# EAGLE design 154N_NAU7802 (EAGLE 9.6.2)
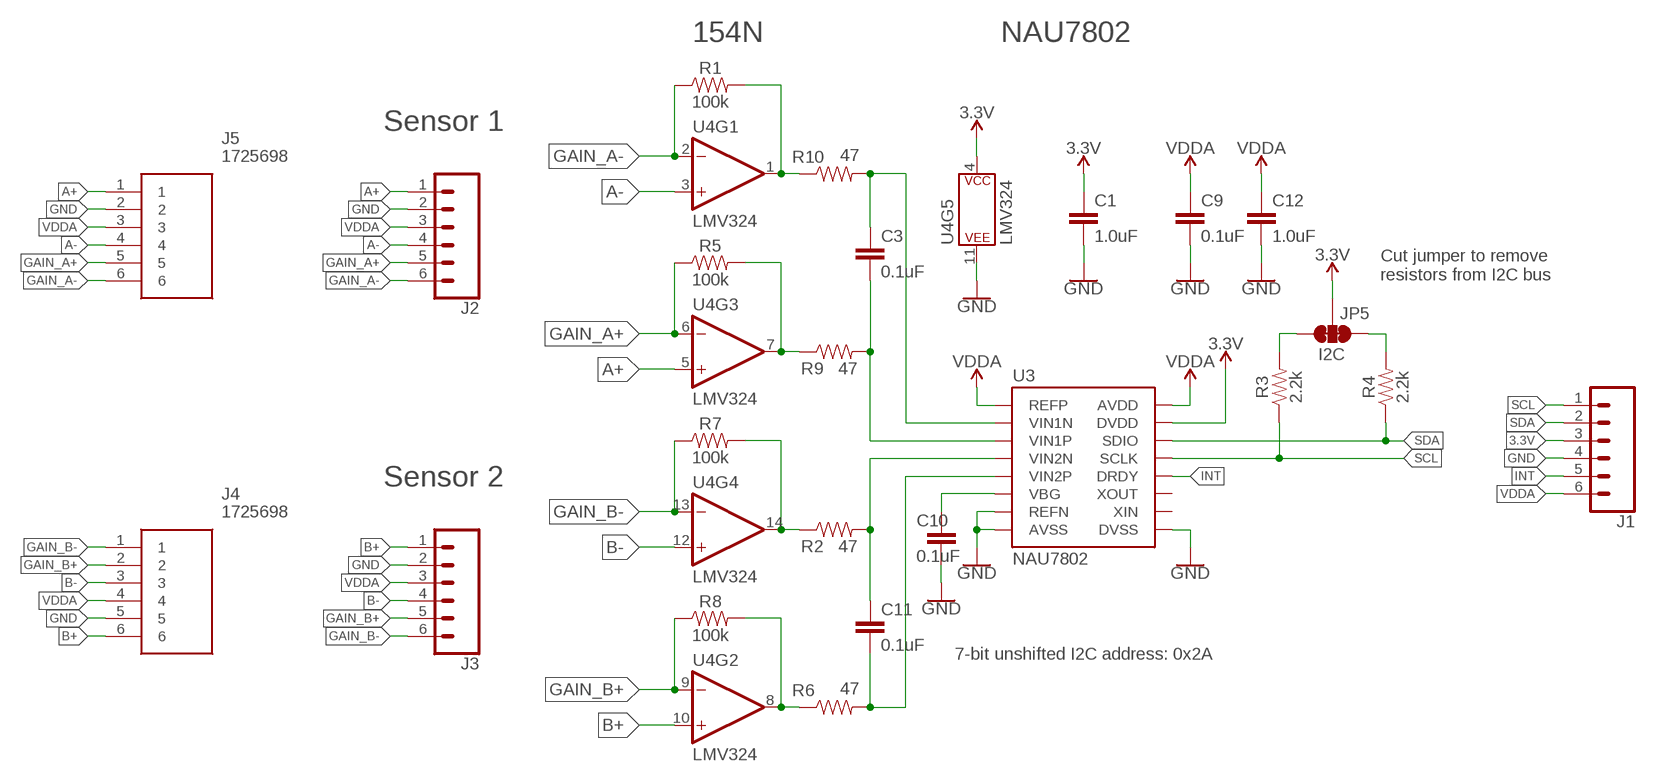
[diagram p0: schematic, sheet 1]

## Parts
C1  1.0uF  1.0UF-0603-16V-10%  [0603]
C3  0.1uF  0.1UF-0603-25V-(+80/-20%)  [0603]
C9  0.1uF  0.1UF-0603-25V-(+80/-20%)  [0603]
C10  0.1uF  0.1UF-0603-25V-(+80/-20%)  [0603]
C11  0.1uF  0.1UF-0603-25V-(+80/-20%)  [0603]
C12  1.0uF  1.0UF-0603-16V-10%  [0603]
J1  CONN_06SILK_FEMALE_PTH  [1X06]
J2  CONN_06SILK_FEMALE_PTH  [1X06]
J3  CONN_06SILK_FEMALE_PTH  [1X06]
J4  1725698  [SHDR6W90P0X254_1X6_1570X620X85]
J5  1725698  [SHDR6W90P0X254_1X6_1570X620X85]
JP5  I2C  JUMPER-SMT_3_2-NC_TRACE_SILK  [SMT-JUMPER_3_2-NC_TRACE_SILK]
R1  100k  100KOHM-0603-1/10W-1%  [0603]
R2  47  47OHM-0603-1/10W-1%  [0603]
R3  2.2k  2.2KOHM-0603-1/10W-1%  [0603]
R4  2.2k  2.2KOHM-0603-1/10W-1%  [0603]
R5  100k  100KOHM-0603-1/10W-1%  [0603]
R6  47  47OHM-0603-1/10W-1%  [0603]
R7  100k  100KOHM-0603-1/10W-1%  [0603]
R8  100k  100KOHM-0603-1/10W-1%  [0603]
R9  47  47OHM-0603-1/10W-1%  [0603]
R10  47  47OHM-0603-1/10W-1%  [0603]
U3  NAU7802  SPARKFUN-IC-CONVERSION_NAU7802SOIC  [SPARKFUN-IC-CONVERSION_SO16]
U4  LMV324  SPARKFUN-IC-AMPLIFIERS_LMV324  [SPARKFUN-IC-AMPLIFIERS_SO14]

## Nets
3.3V [3.3V]: C1.1 J1.3 JP5.2 U3.15(DVDD) U4.4(P$V+)
A+: J2.1 J5.1 U4.5(+IN)
A-: J2.4 J5.4 U4.3(+IN)
B+: J3.1 J4.6 U4.10(+IN)
B-: J3.4 J4.3 U4.12(+IN)
GAIN_A+: J2.5 J5.5 R5.1 U4.6(-IN)
GAIN_A-: J2.6 J5.6 R1.1 U4.2(-IN)
GAIN_B+: J3.5 J4.2 R8.1 U4.9(-IN)
GAIN_B-: J3.6 J4.1 R7.1 U4.13(-IN)
GND: C1.2 C9.2 C10.2 C12.2 J1.4 J2.2 J3.2 J4.5 J5.2 U3.7(REFN) U3.8(AVSS) U3.9(DVSS) U4.11(P$V-)
INT: J1.5 U3.12(DRDY)
N$1: R6.1 R8.2 U4.8(OUT)
N$3: JP5.1 R4.2
N$4: JP5.3 R3.2
N$6: R2.1 R7.2 U4.14(OUT)
N$9: R1.2 R10.1 U4.1(OUT)
N$10: R5.2 R9.1 U4.7(OUT)
N$11: C10.1 U3.6(VBG)
N$12: C3.2 R9.2 U3.3(VIN1P)
N$13: C3.1 R10.2 U3.2(VIN1N)
N$14: C11.2 R6.2 U3.5(VIN2P)
N$15: C11.1 R2.2 U3.4(VIN2N)
SCL: J1.1 R3.1 U3.13(SCLK)
SDA: J1.2 R4.1 U3.14(SDIO)
VDDA: C9.1 C12.1 J1.6 J2.3 J3.3 J4.4 J5.3 U3.1(REFP) U3.16(AVDD)
Unconnected: U3.10(XIN) U3.11(XOUT)

## Notes on the sheet
- 154N | NAU7802
- Sensor 1
- Cut jumper to remove
  resistors from I2C bus
- Sensor 2
- 7-bit unshifted I2C address: 0x2A

## Library data of the parts
C1 C12 = SparkFun-Capacitors:1.0UF: 1µF ceramic capacitors A capacitor is a passive two-terminal electrical component used to store electrical energy temporarily in an electric field.; PROD_ID: CAP-00868
C3 C9-C11 = SparkFun-Capacitors:0.1UF: 0.1µF ceramic capacitors A capacitor is a passive two-terminal electrical component used to store electrical energy temporarily in an electric field.; PROD_ID: CAP-00810
J1-J3 = SparkFun-Connectors:CONN_06: Multi connection point. Often used as Generic Header-pin footprint for 0.1 inch spaced/style header connections On any of the 0.1 inch spaced packages, you can populate with these: Break Away Headers - Straight <https://www.sparkfun.com/products/116> (PRT-00116) Break Away Male Headers - Right Angle <https://www.sparkfun.com/products/553> (PRT-00553) Female Headers <https://www.sparkfun.com/products/115> (PRT-00115) Break Away Headers - Machine Pin <https://www.sparkfun.com/products/117> (PRT-00117) Break Away Female Headers - Swiss Machine Pin <https://www.sparkfun.com/products/743> (PRT-00743) Arduino Stackable Header - 6 Pin <https://www.sparkfun.com/products/9280> (PRT-09280) For SCREWTERMINALS and SPRING TERMINALS visit here: Screw Terimnals on SparkFun.com <https://www.sparkfun.com/search/results?term=Screw+Terminals> (5mm/3.5mm/2.54mm spacing) This device is also useful as a general connection point to wire up your design to another part of your project. Our various solder wires solder well into these plated through hole pads. Hook-Up Wire - Assortment (Stranded, 22 AWG) <https://www.sparkfun.com/products/11375> (PRT-11375) Hook-Up Wire - Assortment (Solid Core, 22 AWG) <https://www.sparkfun.com/products/11367> (PRT-11367) View the entire wire category on our website here <https://www.sparkfun.com/categories/141>; PROD_ID: CONN-08437
J4 J5 = 1725698:1725698: 6 way PCB vertical mount terminal,2.54mm 6 way PCB vertical mount terminal,2.54mm Source: Datasheet; ALLIED_NUMBER: 70054339; DESCRIPTION: 6 way PCB vertical mount terminal,2.54mm 6 way PCB vertical mount terminal,2.54mm; HEIGHT: 8.5mm; MANUFACTURER_NAME: Phoenix Contact; MANUFACTURER_PART_NUMBER: 1725698; RS_PART_NUMBER: 3909045; RS_PRICE-STOCK: https://uk.rs-online.com/web/p/products/3909045
JP5 = SparkFun-Jumpers:JUMPER-SMT_3_2-NC_TRACE: Normally closed trace jumper (2 of 2 connections) This jumper has a trace between all three pads so they are normally closed (NC). Use a razor knife to open the connection(s). For best results follow the IPC guidelines for cutting traces: Cutout at least 0.063 mm (0.005 in). Remove all loose material to clean up the cut area. Seal the cut with an approved epoxy. Reapply solder to reclose the connection(s).
R1 R5 R7 R8 = SparkFun-Resistors:100KOHM: 100kΩ resistor A resistor is a passive two-terminal electrical component that implements electrical resistance as a circuit element. Resistors act to reduce current flow, and, at the same time, act to lower voltage levels within circuits. - Wikipedia; PROD_ID: RES-07828
R2 R6 R9 R10 = SparkFun-Resistors:47OHM: 47Ω resistor A resistor is a passive two-terminal electrical component that implements electrical resistance as a circuit element. Resistors act to reduce current flow, and, at the same time, act to lower voltage levels within circuits. - Wikipedia; PROD_ID: RES-14282
R3 R4 = SparkFun-Resistors:2.2KOHM: 2.2kΩ resistor A resistor is a passive two-terminal electrical component that implements electrical resistance as a circuit element. Resistors act to reduce current flow, and, at the same time, act to lower voltage levels within circuits. - Wikipedia; PROD_ID: RES-08272
U3 = 154N_NAU7802:SPARKFUN-IC-CONVERSION_NAU7802: 24-bit load cell conversion IC with I2C interface in SOIC-16 package. Similar to HX711 but with true I2C interface.; PROD_ID: IC-14299
U4 = 154N_NAU7802:SPARKFUN-IC-AMPLIFIERS_LMV324: IC LMV324 Quad Op Amp Jellybean quad op-amp Datasheet <http://cdn.sparkfun.com/datasheets/Sensors/Sound/LMV324.pdf> SparkFun Products SparkFun Sensor Kit <https://www.sparkfun.com/products/13754> (DEV-13754) SparkFun Inventor's Kit for Arduino 101 <https://www.sparkfun.com/products/13844> (KIT-13844) SparkFun Sound Detector <https://www.sparkfun.com/products/12642> (SEN-12642); PROD_ID: IC-08227

## Net classes
2 3.3V: width 0.406 mm

## Board
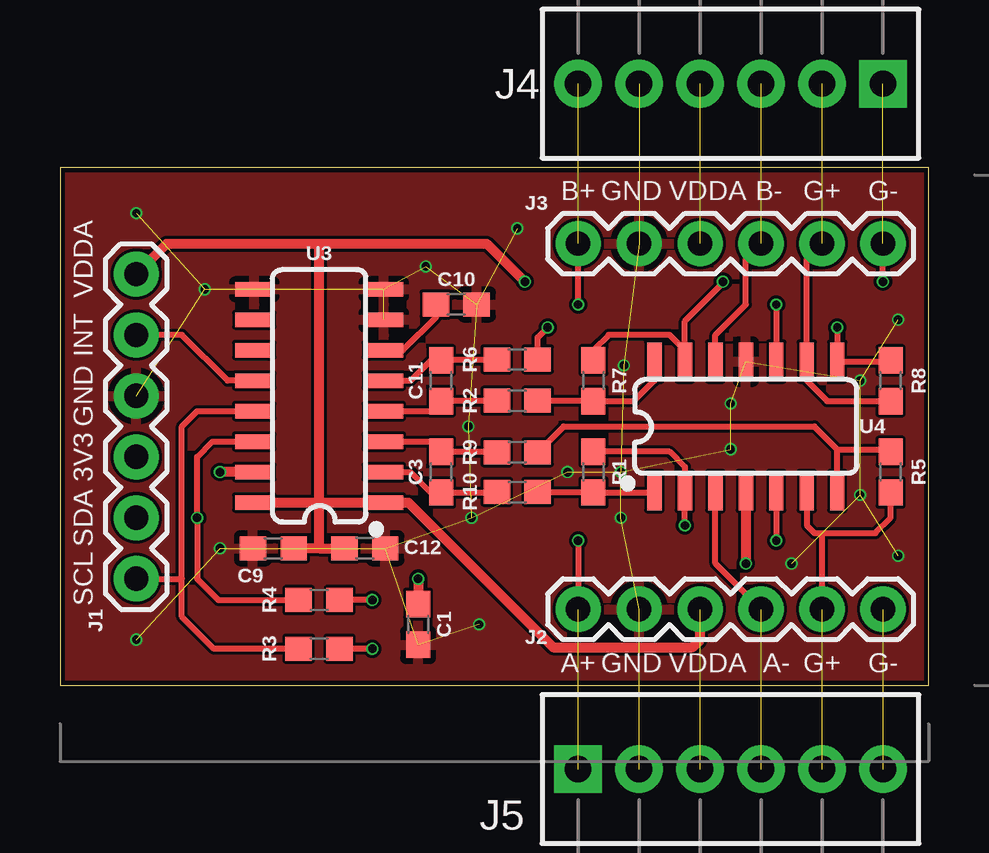
[diagram p1: board, top side]
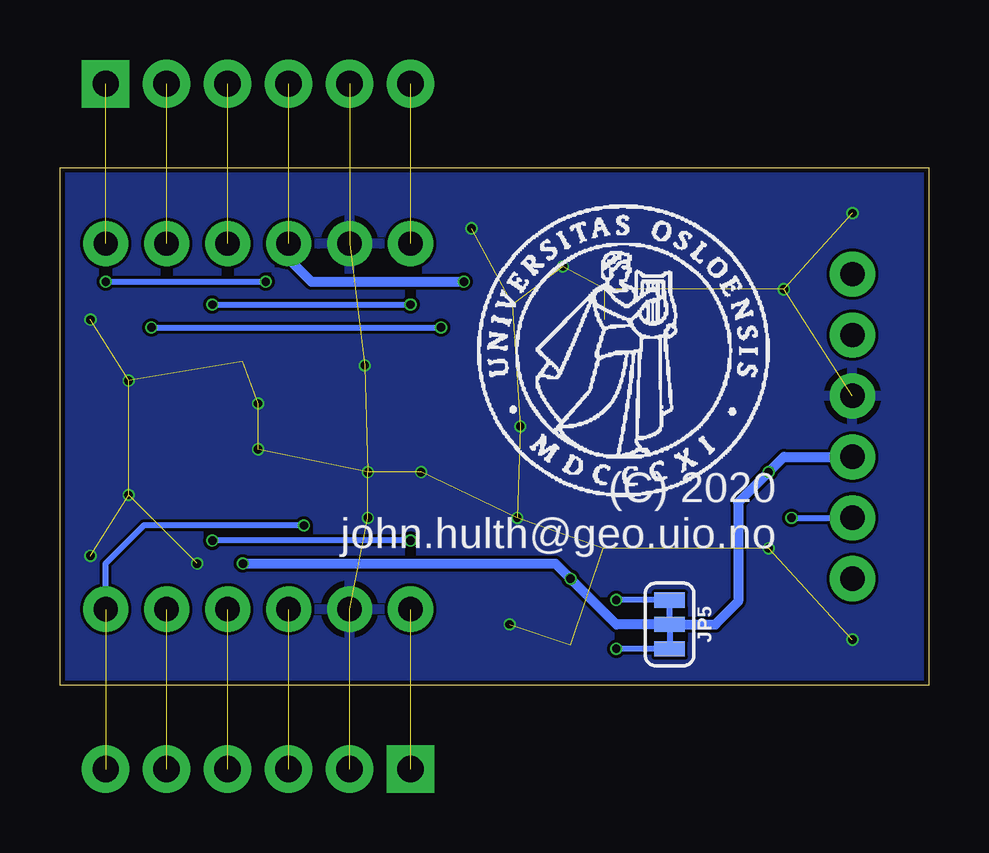
[diagram p2: board, bottom side, seen from below]

Size 36.2 x 21.59 mm. Coordinates in mm from the lower left corner, seen from the top.
Outline: 0,0 36.2,0 36.2,21.59 0,21.59 0,0
Copper layers (1*16): Top 0.035mm / dielectric 1.6mm / Bottom 0.035mm
Design rules "jlcpcb-2layers": minimum track width 5mil, minimum drill 0.3mm, track to track 5mil, track to pad 5mil, pad to pad 5mil, via to via 5mil, smd to smd 5mil, copper to edge 0.2mm, drill to drill 6mil, minimum pad ring 10mil, minimum via ring 3mil, stop-mask expansion 4mil, vias tented up to drill 0mil, thermal gap 10mil

### Footprints (pad centres in the part's own frame; a part is rotated, then mirrored left to right if it is on the bottom)
0603 = smd 1.1 x 1: 1 -0.85,0; 2 0.85,0
1X06 = drill 1.016 pad 1.88: 1 0,0; 2 2.54,0; 3 5.08,0; 4 7.62,0; 5 10.16,0; 6 12.7,0
SHDR6W90P0X254_1X6_1570X620X85 = drill 1.1 pad 1.65 square: 1 0,0 | drill 1.1 pad 1.65: 2 2.54,0; 3 5.08,0; 4 7.62,0; 5 10.16,0; 6 12.7,0
SMT-JUMPER_3_2-NC_TRACE_SILK = smd 0.635 x 1.27: 1 -1.016,0; 2 0,0; 3 1.016,0
SPARKFUN-IC-CONVERSION_SO16 = smd 0.6 x 1.6: 1 -4.445,-2.7; 2 -3.175,-2.7; 3 -1.905,-2.7; 4 -0.635,-2.7; 5 0.635,-2.7; 6 1.905,-2.7; 7 3.175,-2.7; 8 4.445,-2.7; 9 4.445,2.7; 10 3.175,2.7; 11 1.905,2.7; 12 0.635,2.7; 13 -0.635,2.7; 14 -1.905,2.7; 15 -3.175,2.7; 16 -4.445,2.7
SPARKFUN-IC-AMPLIFIERS_SO14 = smd 0.6 x 1.6: 1 -3.175,-2.7; 2 -1.905,-2.7; 3 -0.635,-2.7; 4 0.635,-2.7; 5 1.905,-2.7; 6 3.175,-2.7; 7 4.445,-2.7; 8 4.445,2.7; 9 3.175,2.7; 10 1.905,2.7; 11 0.635,2.7; 12 -0.635,2.7; 13 -1.905,2.7; 14 -3.175,2.7

### Placement (x,y rotation side)
C1  14.92,2.54 270 top
C3  15.88,8.89 90 top
C9  8.89,5.71 180 top
C10  16.51,15.88 0 top
C11  15.88,12.7 90 top
C12  12.7,5.71 0 top
J1  3.17,4.45 90 top
J2  21.59,3.17 0 top
J3  21.59,18.41 0 top
J4  34.29,25.08 180 top  (outside the outline)
J5  21.59,-3.49 0 top  (outside the outline)
JP5  10.79,2.54 270 bottom
R1  22.23,8.89 270 top
R2  19.05,11.87 180 top
R3  10.79,1.52 0 top
R4  10.79,3.56 0 top
R5  34.61,8.89 90 top
R6  19.05,13.59 180 top
R7  22.23,12.7 270 top
R8  34.61,12.7 90 top
R9  19.05,9.72 180 top
R10  19.05,8.06 180 top
U3  10.79,12.06 90 top
U4  27.94,10.79 0 top
U$3  [UIO-LOGO-BL]  19.05,7.62 0 bottom

### Tracks (layer width: path | path; a pad name or v marks a point on that pad's centre or on a via)
3.3V  (via drill 0.35)
  Top 0.406: U3.15 v6.67,8.89 | U4.4 v28.57,5.08 | v14.92,4.45 C1.1
  Bottom 0.406: J1.3 6.03,9.53 v6.67,8.89 7.94,7.62 7.94,3.49 8.89,2.54 JP5.2 13.02,2.54 v14.92,4.45 15.56,5.08 v28.57,5.08
A+  (via drill 0.35)  (1 unrouted)
  Top 0.254: U4.5 v29.84,6.03 | v21.59,6.03 J2.1
  Bottom 0.254: v21.59,6.03 v29.84,6.03
A-  (1 unrouted)
  Top 0.254: J2.4 27.3,5.08 U4.3
B+  (via drill 0.35)  (1 unrouted)
  Top 0.254: v21.59,15.88 J3.1 | v29.84,15.88 U4.10
  Bottom 0.254: v29.84,15.88 v21.59,15.88
B-  (1 unrouted)
  Top 0.254: U4.12 27.3,14.61 28.57,15.88 28.57,17.78 J3.4
GAIN_A+  (1 unrouted)
  Top 0.254: U4.6 31.11,6.67 31.43,6.35 31.75,6.35 | 31.75,6.35 33.97,6.35 34.61,6.99 R5.1 | J2.5 31.75,6.35
GAIN_A-  (via drill 0.35)  (1 unrouted)
  Top 0.254: v26.04,6.67 U4.2 26.04,9.11 25.4,9.74 R1.1
  Bottom 0.254: v26.04,6.67 32.7,6.67 34.29,5.08 J2.6
GAIN_B+  (1 unrouted)
  Top 0.254: J3.5 31.11,17.78 U4.9 31.11,12.7 31.96,11.85 R8.1
GAIN_B-  (via drill 0.35)  (1 unrouted)
  Top 0.254: v27.62,16.83 27.62,16.77 26.04,15.18 U4.13 26.04,13.97 25.4,14.61 22.86,14.61 22.23,13.97 R7.1 | v34.29,16.83 J3.6
  Bottom 0.254: v34.29,16.83 v27.62,16.83
GND  (via drill 0.35)  (32 unrouted)
  other vias: 19.05,19.05 34.92,15.24 33.34,7.94 27.94,11.75 23.5,13.34 17.46,2.54 3.17,1.91 15.24,17.46 3.17,19.68 6.67,5.71 17.14,6.99 6.03,16.51 27.94,9.84 34.92,5.4 30.48,5.08 17.02,10.79 33.34,12.7 21.15,8.89 23.37,8.89 23.37,6.99
  pour Bottom: 0,0 0,22.23 36.2,22.23 36.2,0
  pour Top: 0,0 0,22.86 36.2,22.86 36.2,0
INT
  Top 0.254: U3.12 6.99,12.7 5.08,14.61 J1.5
N$1  (via drill 0.35)
  Top 0.254: R6.1 19.9,14.5 v20.32,14.92 | v32.38,14.92 U4.8 34.55,13.49 R8.2
  Bottom 0.254: v32.38,14.92 v20.32,14.92
N$3  (via drill 0.35)
  Top 0.254: v13.02,3.56 R4.2
  Bottom 0.254: JP5.1 v13.02,3.56
N$4  (via drill 0.35)
  Top 0.254: v13.02,1.52 R3.2
  Bottom 0.254: JP5.3 v13.02,1.52
N$6
  Top 0.254: U4.14 24.77,12.7 23.91,11.85 R7.2 22.2,11.87 R2.1
N$9
  Top 0.254: R10.1 22.2,8.06 R1.2 24.71,8.04 U4.1
N$10
  Top 0.254: R9.1 20.98,10.79 31.43,10.79 32.38,9.84 | U4.7 32.38,9.84 | 32.38,9.84 34.51,9.84 R5.2
N$11
  Top 0.254: U3.6 14.29,13.97 15.66,15.34 C10.1
N$12
  Top 0.254: R9.2 18.18,9.74 C3.2 15.46,10.16 U3.3
N$13
  Top 0.254: R10.2 18.18,8.04 C3.1 15.46,8.04 14.61,8.89 U3.2
N$14
  Top 0.254: U3.5 14.61,12.7 15.46,13.55 C11.2 15.91,13.59 R6.2
N$15
  Top 0.254: U3.4 15.46,11.43 C11.1 15.9,11.87 R2.2
SCL
  Top 0.254: U3.13 5.71,11.43 5.08,10.79 5.08,4.45 | 5.08,4.45 5.08,2.86 6.41,1.52 R3.1 | J1.1 5.08,4.45
SDA  (via drill 0.35)
  Top 0.254: U3.14 6.35,10.16 5.71,9.53 v5.71,6.99 5.71,4.45 6.6,3.56 R4.1
  Bottom 0.254: v5.71,6.99 J1.2
VDDA  (via drill 0.35)  (2 unrouted)
  Top 0.406: U3.16 10.79,7.62 | 10.79,7.62 U3.1 14.51,7.62 20.54,1.59 26.35,1.59 26.67,1.91 J2.3 | 10.79,5.71 C9.1 | 10.79,5.71 C12.1 | 10.79,5.71 10.79,7.62 | 10.79,18.41 17.78,18.41 v19.37,16.83 | J1.6 4.45,18.41 10.79,18.41 | 10.79,7.62 10.79,18.41
  Bottom 0.406: v19.37,16.83 25.72,16.83 26.67,17.78 J3.3

### Text on the board
bPlace: (C) 2020 / john.hulth@geo.uio.no
tNames: B+ | GND | VDDA | B- | G+ | G- | VDDA | INT | GND | 3V3 | SDA | SCL | A+ | GND | VDDA | A- | G+ | G-